# Altium schematic sheet Analog_isolation.SchDoc
size 420 x 297 mm; Address1: Address1; Address2: Address2; Address3: Address3; Address4: Address4; DocumentNumber: *Э3; SheetNumber: 14; SheetTotal: 14; DocumentType: Схема электрическая *
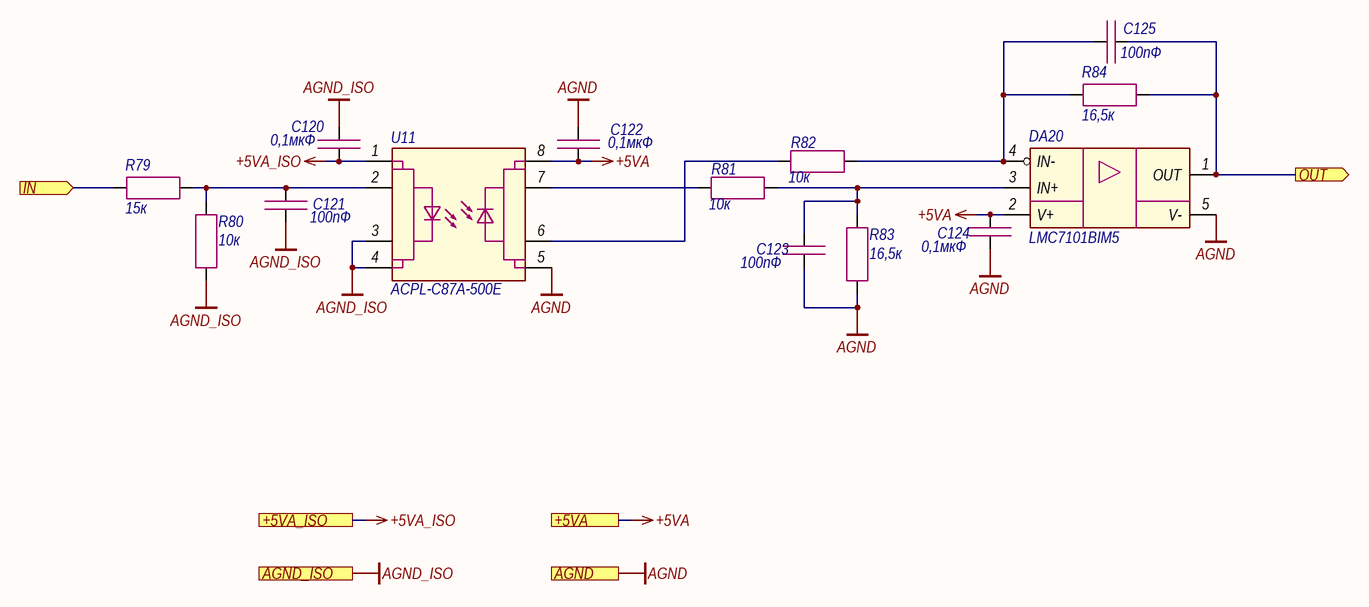
[diagram p0: Analog_isolation.SchDoc]

## Parts
C120  0,1мкФ  [CAP_0603]
C121  100пФ  [CAP_0603]
C122  0,1мкФ  [CAP_0603]
C123  100пФ  [CAP_0603]
C124  0,1мкФ  [CAP_0603]
C125  100пФ  [CAP_0603]
DA20  LMC7101BIM5  [SOT-23-5]
R79  15к  [RES_0603]
R80  10к  [RES_0603]
R81  10к  [RES_0603]
R82  10к  [RES_0603]
R83  16,5к  [RES_0603]
R84  16,5к  [RES_0603]
U11  ACPL-C87A-500E  [SSO-8]

## Ports
+5VA (see Main[1C], LD_driver[1D], Photodiode[1C]), +5VA_ISO (see Main[1C]), AGND (see Main[1C], LD_driver[1D], Photodiode[1D], Thermistor[2C]), AGND_ISO (see Main[1C]), IN (in, see Main[1C]), OUT (out, see Main[1C])

## Nets
+5VA: C122.1 C124.1 DA20.2(V+) U11.8(VDD2) ; port +5VA
+5VA_ISO: C120.1 U11.1(VDD1) ; port +5VA_ISO
AGND: C122.2 C123.2 C124.2 DA20.5(V-) R83.2 U11.5(GND2) ; port AGND
AGND_ISO: C120.2 C121.1 R80.2 U11.3(SHDN) U11.4(GND1) ; port AGND_ISO
IN: R79.2 ; port IN
OUT: C125.2 DA20.1(OUT) R84.1 ; port OUT
NetC121_2: C121.2 R79.1 R80.1 U11.2(VIN)
NetC123_1: C123.1 DA20.3(IN+) R81.2 R83.1
NetC125_1: C125.1 DA20.4(IN-) R82.2 R84.2
NetR81_1: R81.1 U11.7(VOUT+)
NetR82_1: R82.1 U11.6(VOUT-)

## Notes on the sheet
- Подп. и дата
- Инв. № дубл.
- Взам. инв. №
- Инв. № подл.
- Изм.
- Лист
- № докум.
- Подп.
- Дата
- Копировал
- Формат А3

## Library data of the parts
C120 C122 C124 = Capacitor: Manufacturer: Murata; Model: GRM188R71H104KA93D; Value: 0,1мкФ; Document: *
C121 C123 C125 = Capacitor: Manufacturer: Murata; Model: GRM1885C1H101JA01D; Value: 100пФ; Document: *
DA20 = LMC7101: Manufacturer: Texas Instruments; Model: LMC7101BIM5; Document: *
R79 = Resistor: Manufacturer: Yageo; Model: RC0603FR-0715KL; Value: 15к; Document: *
R80-R82 = Resistor: Manufacturer: Yageo; Model: RC0603FR-0710KL; Value: 10к; Document: *
R83 R84 = Resistor: Manufacturer: Yageo; Model: RC0603FR-0716K5L; Value: 16,5к; Document: *
U11 = ACPL-C87: Manufacturer: Broadcom; Model: ACPL-C87A-500E